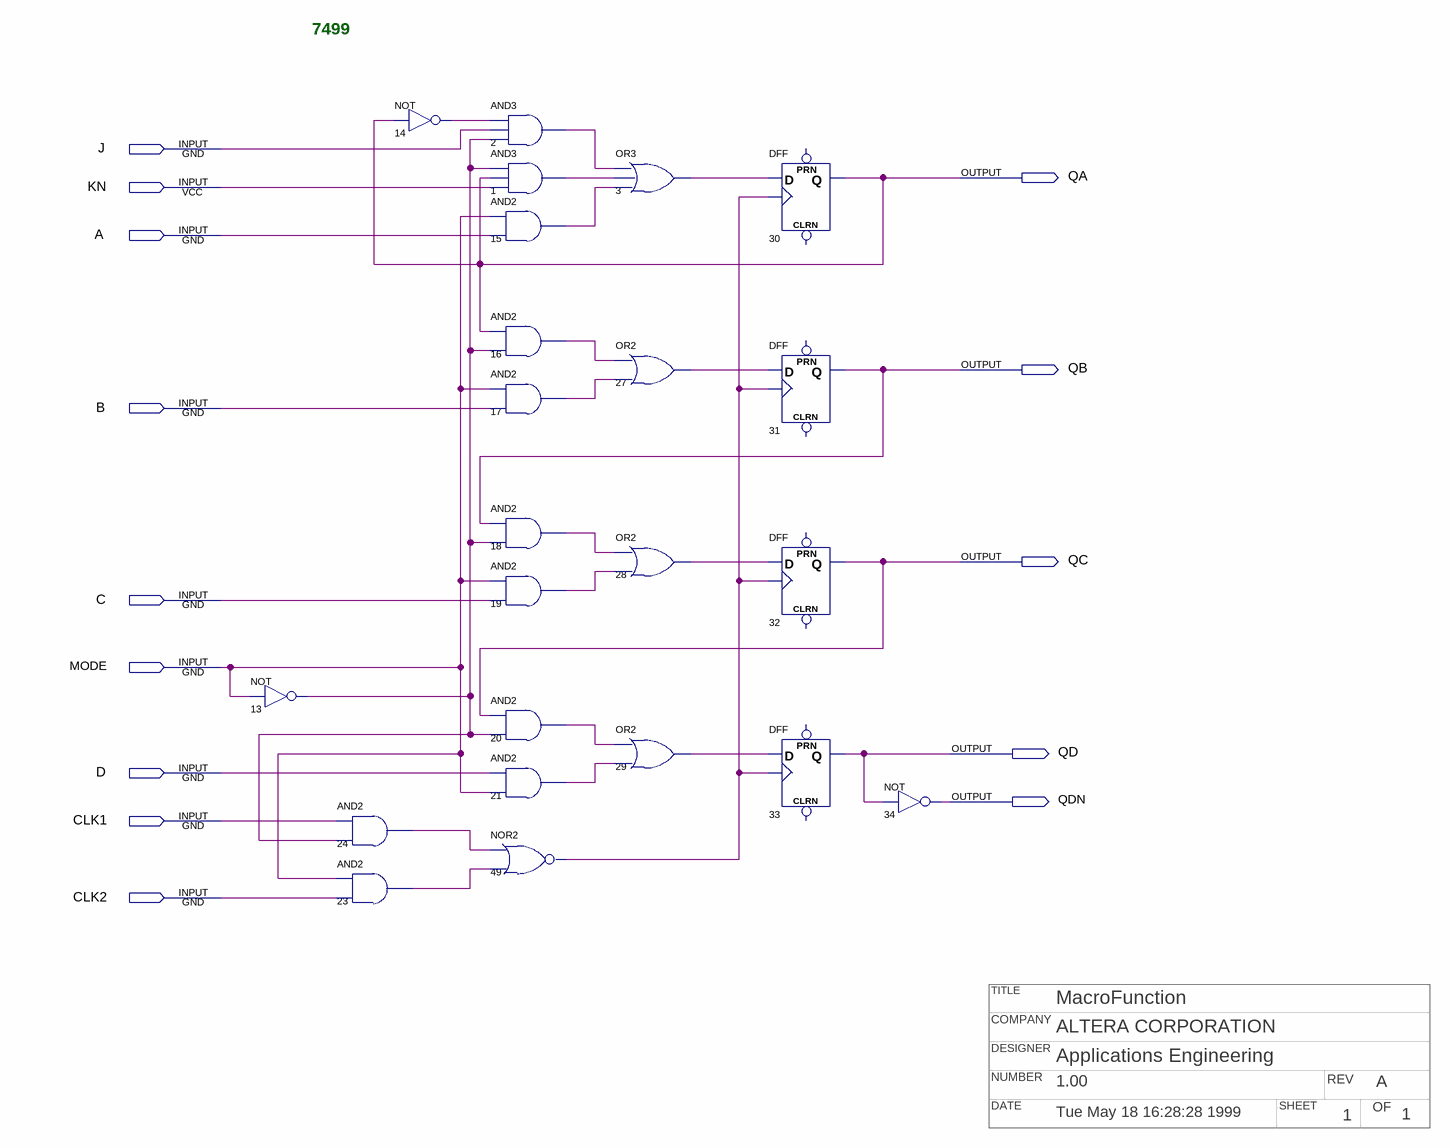
[diagram p0: schematic sheet]
// Quartus schematic 7499.bdf as structural Verilog: 23 symbols, 14 pins
// Title block: TITLE: MacroFunction; COMPANY: ALTERA CORPORATION; DESIGNER: Applications Engineering; NUMBER: 1.00; REV: A; DATE: Tue May 18 16:28:28 1999; SHEET: 1; OF: 1
module \7499  (
  input  J,
  input  KN,
  input  A,
  input  B,
  input  C,
  input  MODE,
  input  D,
  input  CLK1,
  input  CLK2,
  output QA,
  output QB,
  output QC,
  output QD,
  output QDN
);

  wire n1_out, n2_out, n3_out, n13_out, n14_out, n15_out, n16_out, n17_out, n18_out, n19_out, n20_out,
       n21_out, n23_out, n24_out, n27_out, n28_out, n29_out, n49_out;

  not u_13 (n13_out, MODE);
  and u_24 (n24_out, CLK1, n13_out);
  and u_23 (n23_out, MODE, CLK2);
  not u_14 (n14_out, QA);
  and u_2 (n2_out, n14_out, J, n13_out);
  and u_1 (n1_out, n13_out, QA, KN);
  and u_15 (n15_out, MODE, A);
  and u_16 (n16_out, QA, n13_out);
  and u_17 (n17_out, MODE, B);
  and u_18 (n18_out, QB, n13_out);
  and u_19 (n19_out, MODE, C);
  and u_20 (n20_out, QC, n13_out);
  and u_21 (n21_out, D, MODE);
  nor u_49 (n49_out, n24_out, n23_out);
  or u_3 (n3_out, n2_out, n1_out, n15_out);
  or u_27 (n27_out, n16_out, n17_out);
  or u_28 (n28_out, n18_out, n19_out);
  or u_29 (n29_out, n20_out, n21_out);
  DFF u_30 (.CLK(n49_out), .D(n3_out), .Q(QA));  // open: CLRN, PRN
  DFF u_31 (.CLK(n49_out), .D(n27_out), .Q(QB));  // open: CLRN, PRN
  DFF u_32 (.CLK(n49_out), .D(n28_out), .Q(QC));  // open: CLRN, PRN
  DFF u_33 (.CLK(n49_out), .D(n29_out), .Q(QD));  // open: CLRN, PRN
  not u_34 (QDN, QD);

  // Notes on the sheet:
  //   7499
endmodule
